# Altium schematic sheet SCH-HC15C_REV2_PG1.SchDoc: MODEL: HC 15C
size 863 x 558 mm; DocumentNumber: SCH-HC15C; SheetNumber: 1; SheetTotal: 3; Title2: HAB'S 1ST GEN CALCULATOR; PageSetup: Record=PageOptions|CenterHorizontal=True|CenterVertical=True|PrintScale=0.48|XCorrection=1.00|YCorrection=1.00|PrintKind=1|BorderSize=5000000|LeftOffset=0|BottomOffset=0|Orientation=2|PaperLength=1000|PaperWidth=1000|Scale=100|PaperSource=7|PrintQuality=-4|MediaType=1|DitherType=10|PaperKind=11x17|PrintScaleMode=1
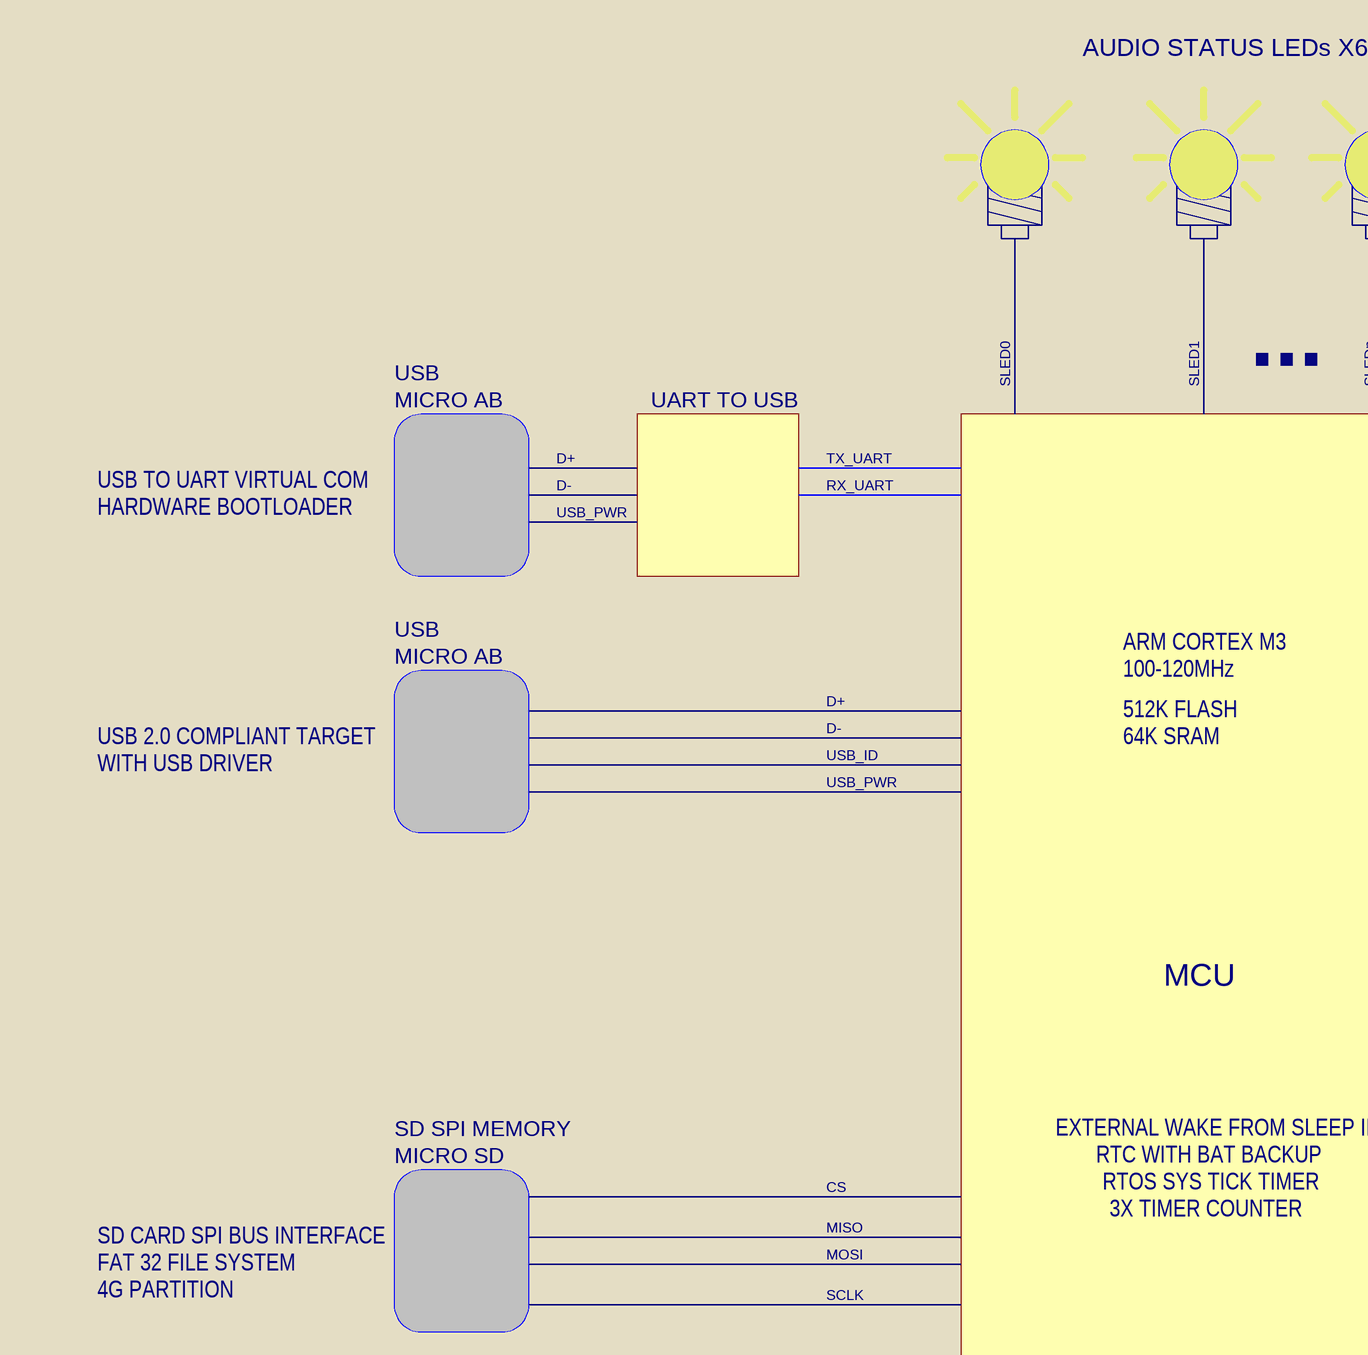
[diagram p0: SCH-HC15C_REV2_PG1.SchDoc, top left]
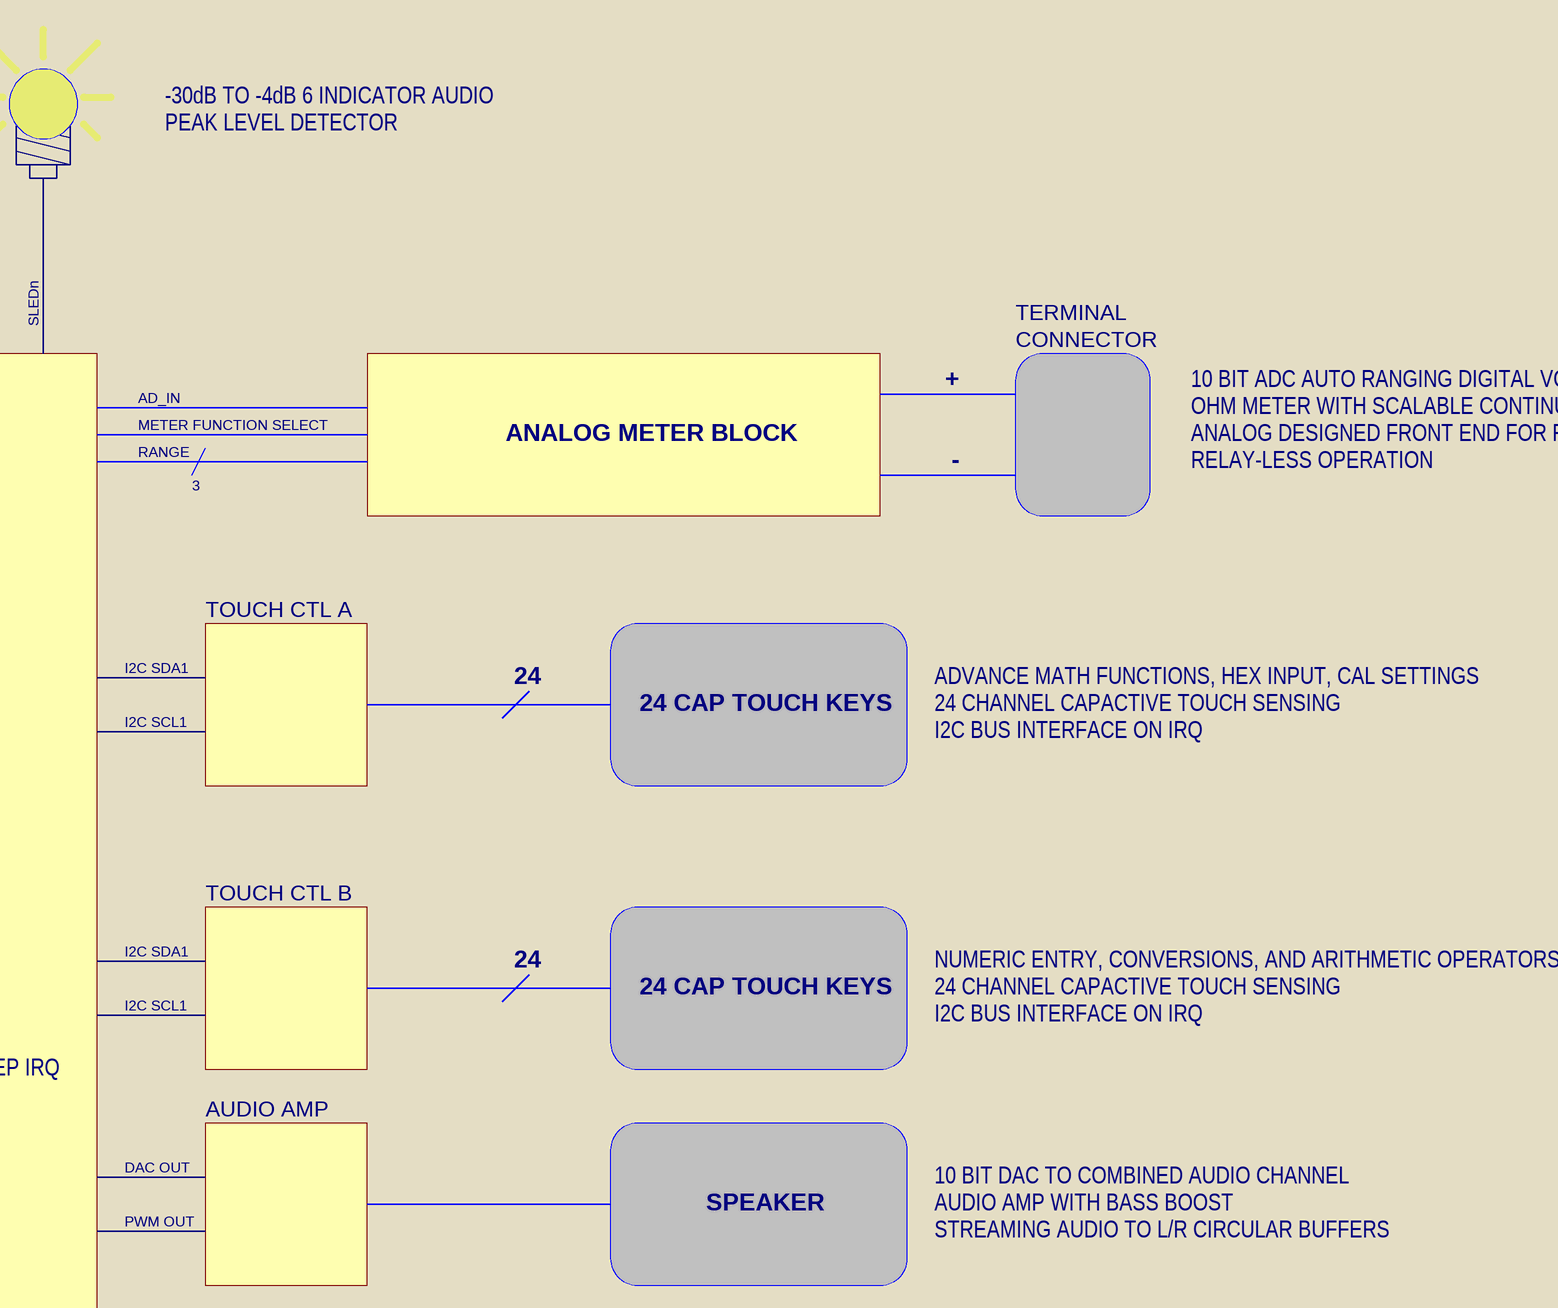
[diagram p1: SCH-HC15C_REV2_PG1.SchDoc, top middle]
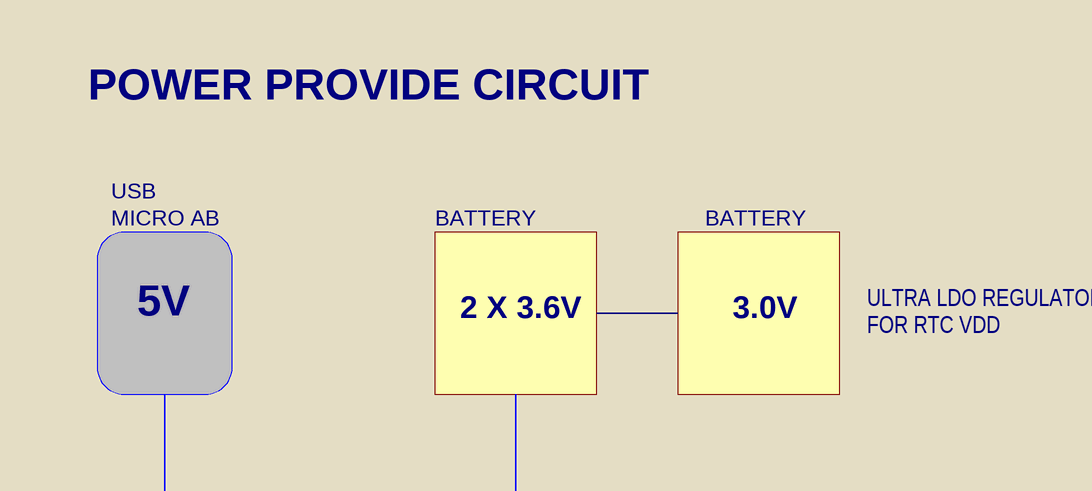
[diagram p2: SCH-HC15C_REV2_PG1.SchDoc, top right]
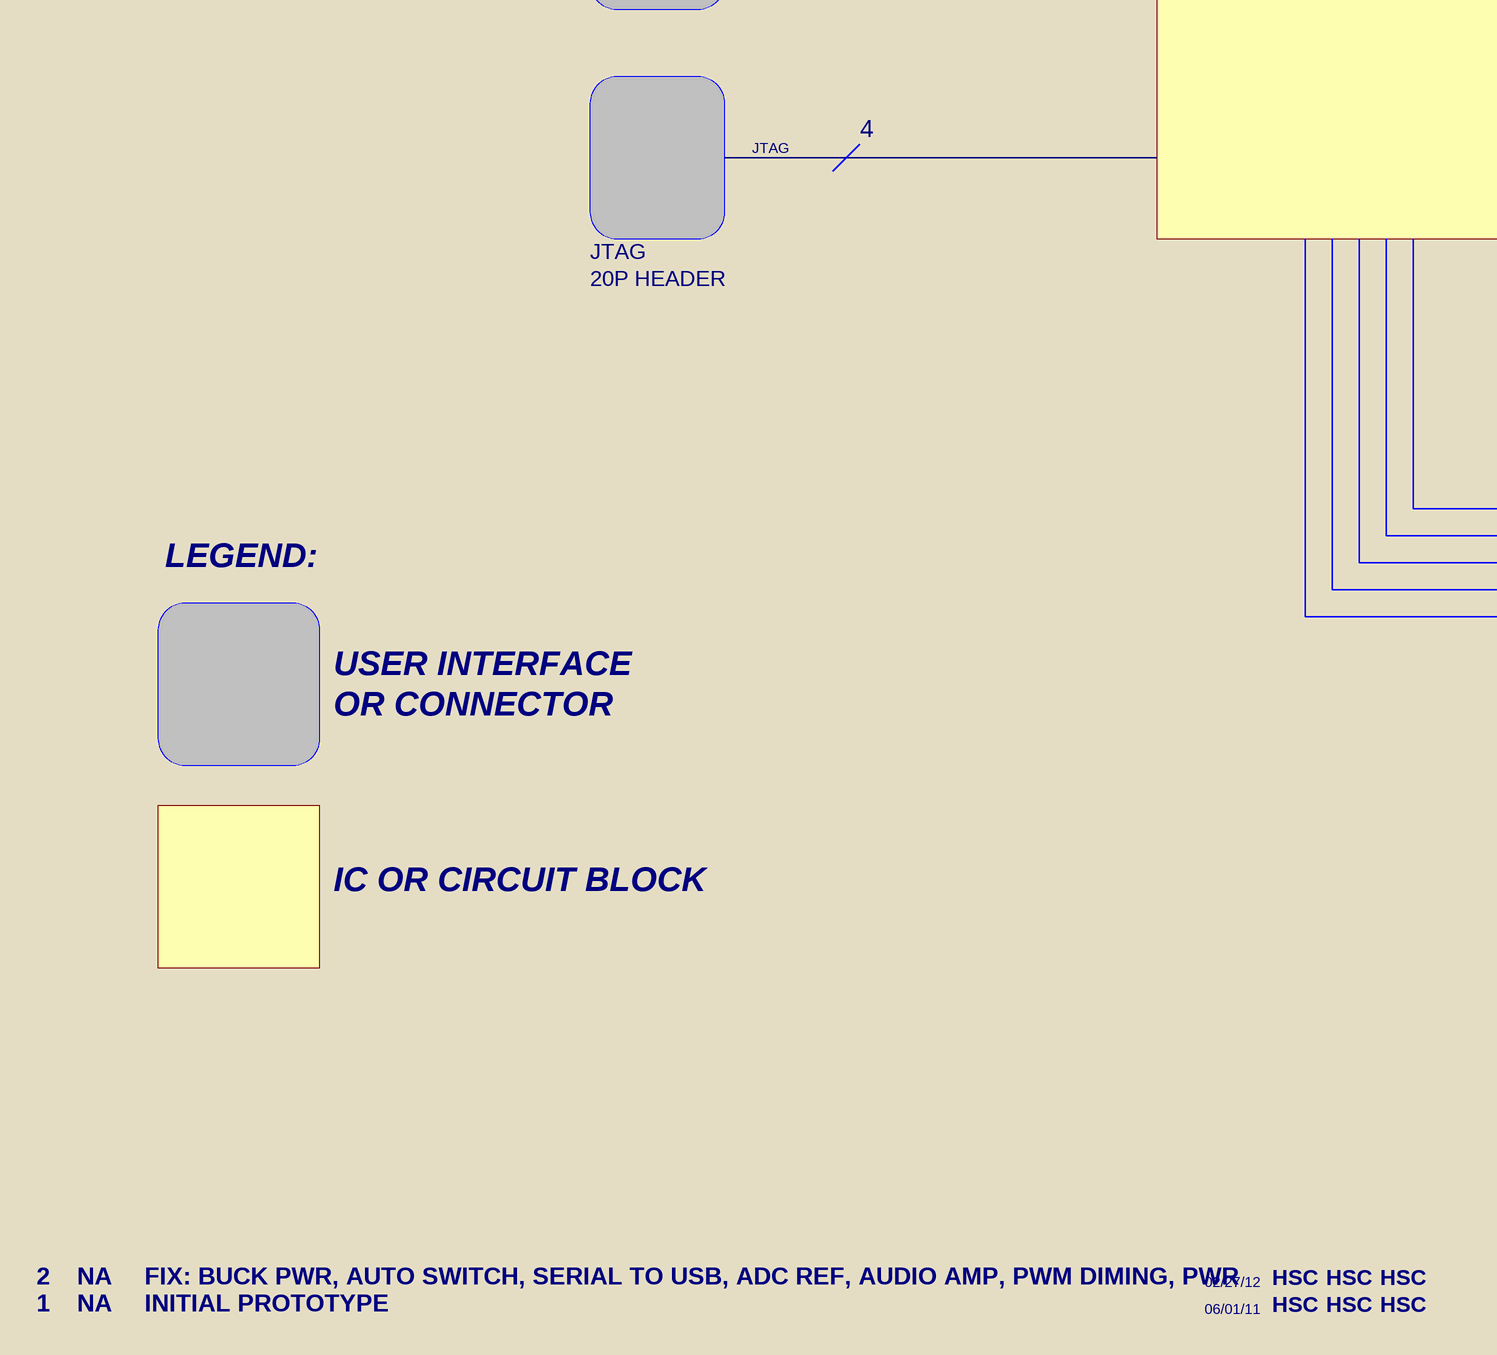
[diagram p3: SCH-HC15C_REV2_PG1.SchDoc, bottom left]
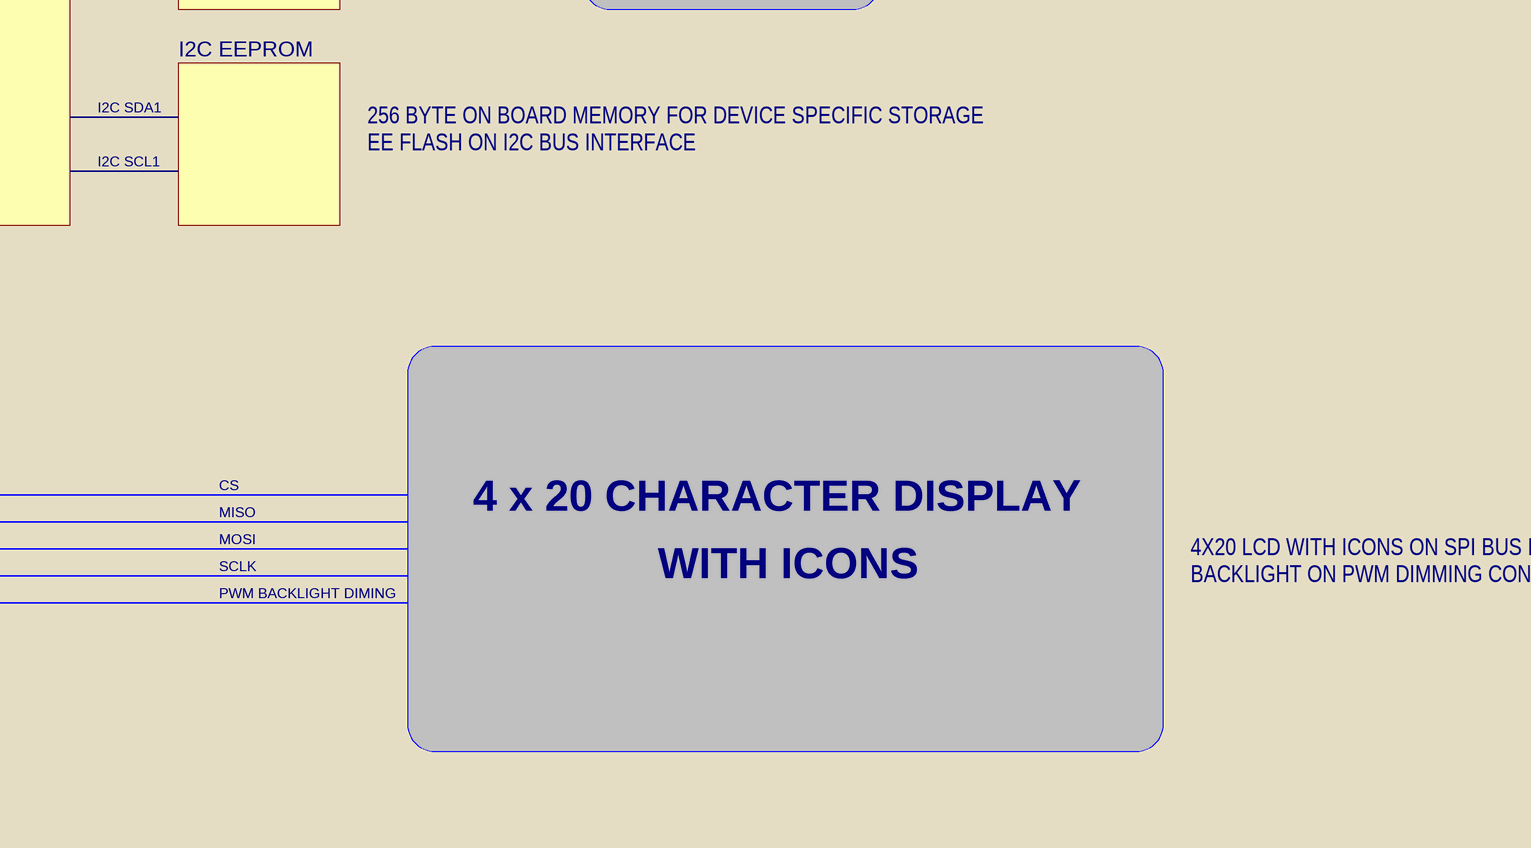
[diagram p4: SCH-HC15C_REV2_PG1.SchDoc, bottom middle]
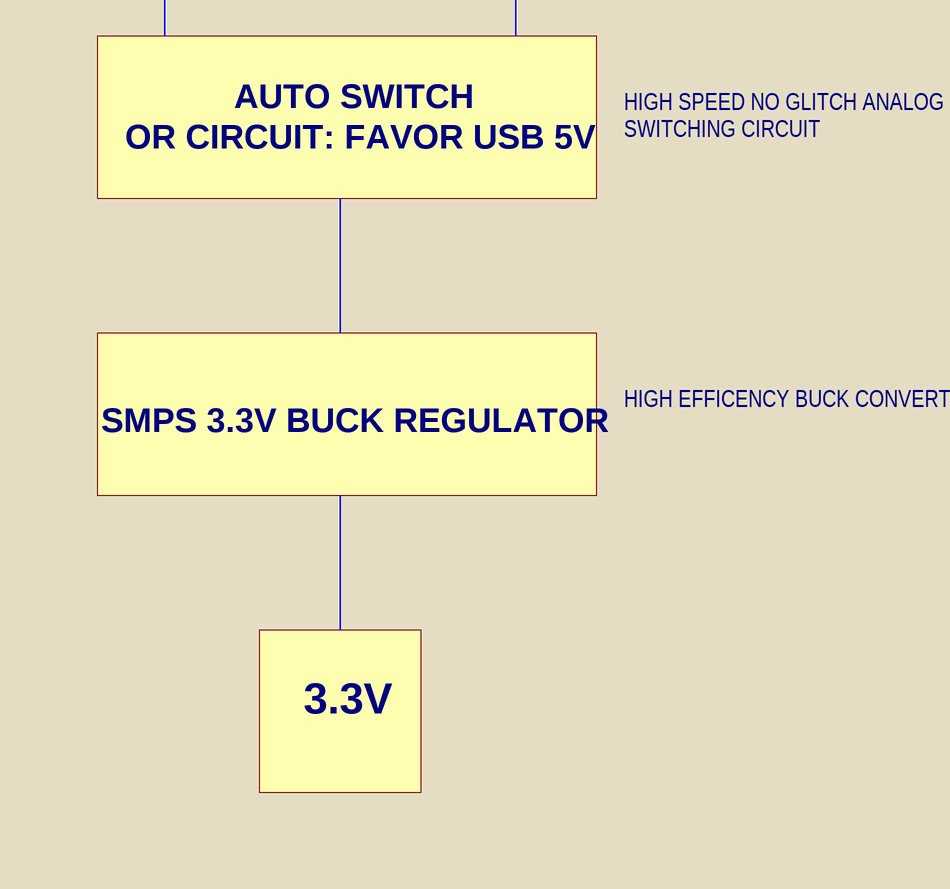
[diagram p5: SCH-HC15C_REV2_PG1.SchDoc, bottom right]

## Notes on the sheet
- AUDIO STATUS LEDs X6
- -30dB TO -4dB 6 INDICATOR AUDIO
- PEAK LEVEL DETECTOR
- MICRO AB
- USB
- UART TO USB
- SLED0
- SLED1
- ...
- SLEDn
- CONNECTOR
- TERMINAL
- USB TO UART VIRTUAL COM
- D+
- D-
- TX_UART
- RX_UART
- AD_IN
- METER FUNCTION SELECT
- +
- 10 BIT ADC AUTO RANGING DIGITAL VOLT METER
- OHM METER WITH SCALABLE CONTINUITY
- HARDWARE BOOTLOADER
- USB_PWR
- RANGE
- 3
- ANALOG METER BLOCK
- -
- ANALOG DESIGNED FRONT END FOR RANGE AND METER FUNCTIOIN SELECTION
- RELAY-LESS OPERATION
- ARM CORTEX M3
- 100-120MHz
- TOUCH CTL A
- USB 2.0 COMPLIANT TARGET
- USB_ID
- 512K FLASH
- 64K SRAM
- I2C SDA1
- 24
- ADVANCE MATH FUNCTIONS, HEX INPUT, CAL SETTINGS
- WITH USB DRIVER
- I2C SCL1
- 24 CAP TOUCH KEYS
- 24 CHANNEL CAPACTIVE TOUCH SENSING
- I2C BUS INTERFACE ON IRQ
- TOUCH CTL B
- POWER PROVIDE CIRCUIT
- MCU
- NUMERIC ENTRY, CONVERSIONS, AND ARITHMETIC OPERATORS
- BATTERY
- SD SPI MEMORY
- MICRO SD
- EXTERNAL WAKE FROM SLEEP IRQ
- RTC WITH BAT BACKUP
- 5V
- 2 X 3.6V
- 3.0V
- ULTRA LDO REGULATOR
- FOR RTC VDD
- MISO
- CS
- RTOS SYS TICK TIMER
- 3X TIMER COUNTER
- DAC OUT
- AUDIO AMP
- SD CARD SPI BUS INTERFACE
- FAT 32 FILE SYSTEM
- 4G PARTITION
- MOSI
- SCLK
- PWM OUT
- SPEAKER
- 10 BIT DAC TO COMBINED AUDIO CHANNEL
- STREAMING AUDIO TO L/R CIRCULAR BUFFERS
- AUDIO AMP WITH BASS BOOST
- I2C EEPROM
- AUTO SWITCH
- HIGH SPEED NO GLITCH ANALOG DESIGN
- JTAG
- 4
- EE FLASH ON I2C BUS INTERFACE
- 256 BYTE ON BOARD MEMORY FOR DEVICE SPECIFIC STORAGE
- OR CIRCUIT: FAVOR USB 5V
- SWITCHING CIRCUIT
- 20P HEADER
- SMPS 3.3V BUCK REGULATOR
- HIGH EFFICENCY BUCK CONVERTER
- LEGEND:
- 4 x 20 CHARACTER DISPLAY
- 4X20 LCD WITH ICONS ON SPI BUS INTERFACE
- PWM BACKLIGHT DIMING
- WITH ICONS
- BACKLIGHT ON PWM DIMMING CONTROL
- USER INTERFACE
- OR CONNECTOR
- 3.3V
- IC OR CIRCUIT BLOCK
- 1
- 2
- NA
- INITIAL PROTOTYPE
- FIX: BUCK PWR, AUTO SWITCH, SERIAL TO USB, ADC REF, AUDIO AMP, PWM DIMING, PWR
- 06/01/11
- 02/27/12
- HSC
- TITLE:
- SHEET:
- OF
- SCHEMATIC
- DRAWING #:
- 3621 GIN WAY
- CONYERS, GA 30039
- INFORMATION CONTAINED HEREIN IS THE PROPERTY OF Hab Collector
- DBA HabWorks AND IS TO BE HELD IN COMPLETE CONFIDENCE.
- PHONE: 678-687-0270
- FILENAME:
- FILETYPE:
- REV
- ECO#
- DESCRIPTION
- DATE
- DRW
- CHK
- APR
- REPRODUCE WITH WRITTEN CONSENT ONLY.
- ALTIUM